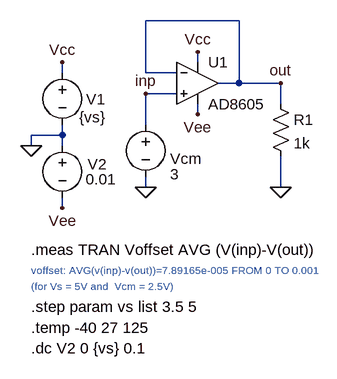
[diagram p0: schematic 02-AD8605 Vos dc simulation .asc]
02-AD8605 Vos dc simulation .asc, the LTspice schematic file:
Version 4
SHEET 1 880 680
WIRE 112 48 -32 48
WIRE 48 112 48 96
WIRE -160 128 -160 112
WIRE -32 128 -32 48
WIRE 16 128 -32 128
WIRE 112 144 112 48
WIRE 112 144 80 144
WIRE 176 144 112 144
WIRE 16 160 -32 160
WIRE 176 176 176 144
WIRE 48 192 48 176
WIRE -32 208 -32 160
WIRE -160 224 -160 208
WIRE -160 224 -208 224
WIRE -208 240 -208 224
WIRE -160 240 -160 224
WIRE -32 304 -32 288
WIRE 176 304 176 256
WIRE -160 336 -160 320
FLAG -160 112 Vcc
FLAG 48 96 Vcc
FLAG -32 304 0
FLAG 176 304 0
FLAG 176 144 out
FLAG -32 160 inp
FLAG -208 240 0
FLAG -160 336 Vee
FLAG 48 192 Vee
SYMBOL Opamps\\AD8605 48 80 R0
SYMATTR InstName U1
SYMBOL voltage -160 112 R0
WINDOW 123 0 0 Left 0
WINDOW 39 0 0 Left 0
WINDOW 0 37 57 Left 2
WINDOW 3 26 84 Left 2
SYMATTR InstName V1
SYMATTR Value {vs}
SYMBOL voltage -32 192 R0
WINDOW 123 0 0 Left 0
WINDOW 39 0 0 Left 0
WINDOW 0 38 68 Left 2
WINDOW 3 38 92 Left 2
SYMATTR InstName Vcm
SYMATTR Value 3
SYMBOL res 160 160 R0
SYMATTR InstName R1
SYMATTR Value 1k
SYMBOL voltage -160 224 R0
WINDOW 123 0 0 Left 0
WINDOW 39 0 0 Left 0
WINDOW 0 39 45 Left 2
WINDOW 3 36 68 Left 2
SYMATTR InstName V2
SYMATTR Value 0.01
TEXT -208 400 Left 2 !.meas TRAN Voffset AVG (V(inp)-V(out))
TEXT -208 432 Left 1 ;voffset: AVG(v(inp)-v(out))=7.89165e-005 FROM 0 TO 0.001
TEXT -208 552 Left 2 !.dc V2 0 {vs} 0.1
TEXT -208 488 Left 2 !.step param vs list 3.5 5
TEXT -208 520 Left 2 !.temp -40 27 125
TEXT -208 456 Left 1 ;(for Vs = 5V and  Vcm = 2.5V)

The netlist it stands for:
* 02-AD8605 Vos dc simulation .asc
XU1 inp out Vcc Vee out AD8605  ; pins In+ In- V+ V- OUT
V1 Vcc 0 {vs}
Vcm inp 0 3
R1 out 0 1k
V2 0 Vee 0.01
.meas TRAN Voffset AVG (V(inp)-V(out))
* voffset: AVG(v(inp)-v(out))=7.89165e-005 FROM 0 TO 0.001
.dc V2 0 {vs} 0.1
.step param vs list 3.5 5
.temp -40 27 125
* (for Vs = 5V and  Vcm = 2.5V)
.lib ADI.lib
.backanno
.end

* Results of the author's LTspice run, read from the files saved beside the schematic
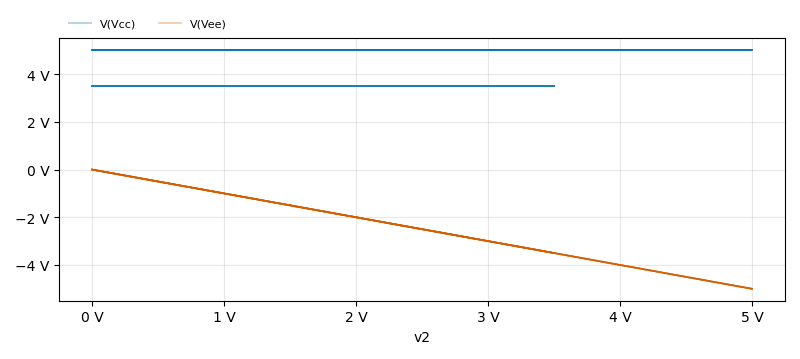
[diagram p1: DC transfer characteristic of 02-AD8605 Vos dc simulation .asc, plotted from the saved traces]
* DC transfer characteristic, 6 runs:
*   V(Vcc) [vs=3.5 temp=-40°C]: 3.5 V at v2=0 V, 3.5 V at v2=3.5 V, min 3.5 V, max 3.5 V
*   V(Vcc) [vs=5 temp=-40°C]: 5 V at v2=0 V, 5 V at v2=5 V, min 5 V, max 5 V
*   V(Vcc) [vs=3.5 temp=27°C]: 3.5 V at v2=0 V, 3.5 V at v2=3.5 V, min 3.5 V, max 3.5 V
*   V(Vcc) [vs=5 temp=27°C]: 5 V at v2=0 V, 5 V at v2=5 V, min 5 V, max 5 V
*   V(Vcc) [vs=3.5 temp=125°C]: 3.5 V at v2=0 V, 3.5 V at v2=3.5 V, min 3.5 V, max 3.5 V
*   V(Vcc) [vs=5 temp=125°C]: 5 V at v2=0 V, 5 V at v2=5 V, min 5 V, max 5 V
*   V(Vee) [vs=3.5 temp=-40°C]: 0 V at v2=0 V, -3.5 V at v2=3.5 V, min -3.5 V, max 0 V
*   V(Vee) [vs=5 temp=-40°C]: 0 V at v2=0 V, -5 V at v2=5 V, min -5 V, max 0 V
*   V(Vee) [vs=3.5 temp=27°C]: 0 V at v2=0 V, -3.5 V at v2=3.5 V, min -3.5 V, max 0 V
*   V(Vee) [vs=5 temp=27°C]: 0 V at v2=0 V, -5 V at v2=5 V, min -5 V, max 0 V
*   V(Vee) [vs=3.5 temp=125°C]: 0 V at v2=0 V, -3.5 V at v2=3.5 V, min -3.5 V, max 0 V
*   V(Vee) [vs=5 temp=125°C]: 0 V at v2=0 V, -5 V at v2=5 V, min -5 V, max 0 V